# EAGLE design openevse-ac-filter-eagle7 (EAGLE 7.7.0)
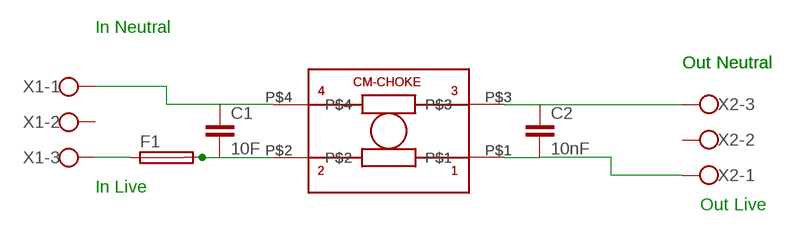
[diagram p0: schematic, sheet 1]

## Parts
C1  10F  C5/2.5  [C5B2.5]
C2  10nF  C5/2.5  [C5B2.5]
F1  GSH15  [GSH15]
U$1  47mH  RN114-0.3-02-47M  [RN114-0.3-02-47M]
U$2  RN214-0.3-02-47M  [RN214-0.3-02-47M]
X1  W237-103  [W237-103]
X2  W237-103  [W237-103]

## Nets
N$1: C1.1 U$1.P$4 U$2.P$4 X1.1
N$2: C1.2 F1.2 U$1.P$2 U$2.P$2
N$3: C2.1 U$1.P$3 U$2.P$3 X2.3
N$4: C2.2 U$1.P$1 U$2.P$1 X2.1
N$5: F1.1 X1.3
Unconnected: X1.2 X2.2

## Notes on the sheet
- In Neutral
- Out Neutral | Out Neutral
- In Live
- Out Live

## Library data of the parts
C1 C2 = capacitor-wima:C: CAPACITOR naming: grid - package width
F1 = fuse:GSH15: FUSE HOLDER grid 15mm, 19649 Wickmann; MPN: 64900001039; OC_FARNELL: 1271673; OC_NEWARK: 02P0318
U$1 = Schaffner-CM-Choke:RN114-0.3-02-47M
U$2 = Schaffner-CM-Choke:RN214-0.3-02-47M
X1 X2 = con-wago-500:W237-103: WAGO SCREW CLAMP; MPN: 237-103; OC_FARNELL: unknown; OC_NEWARK: 18M7116

## Board
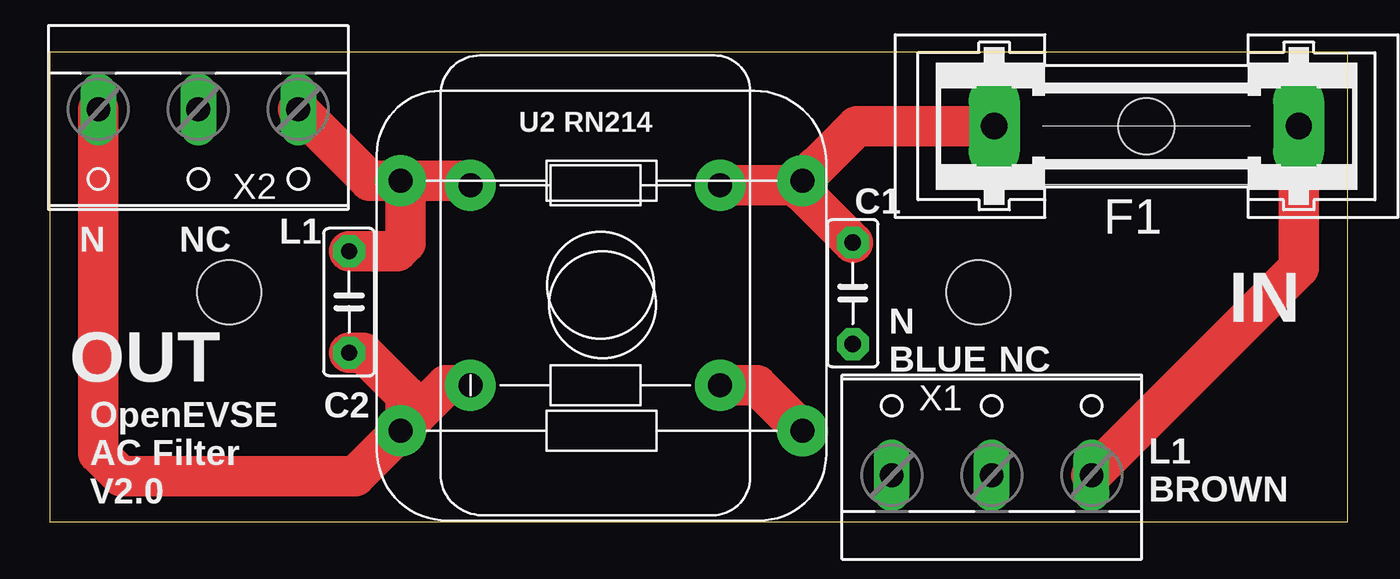
[diagram p1: board, top side]
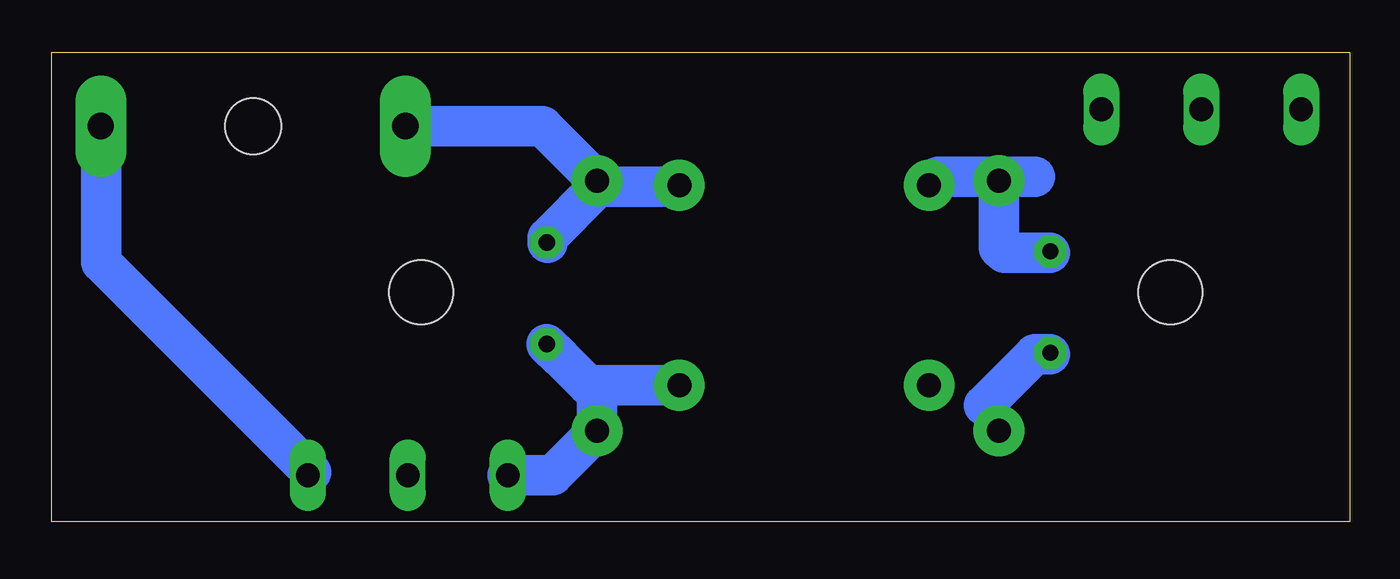
[diagram p2: board, bottom side, seen from below]

Size 64.94 x 23.5 mm. Coordinates in mm from the lower left corner, seen from the top.
Outline: 0,0 64.94,0 64.94,23.5 0,23.5 0,0
Copper layers (1*16): Top 0.035mm / dielectric 1.5mm / Bottom 0.035mm
Design rules "default": minimum track width 10mil, minimum drill 24mil, track to track 8mil, track to pad 8mil, pad to pad 8mil, via to via 8mil, smd to smd 8mil, copper to edge 40mil, drill to drill 8mil, minimum pad ring 10mil, minimum via ring 8mil, stop-mask expansion 4mil, vias tented up to drill 0mil, thermal gap 10mil
Holes 3.2 mm at 8.97,11.5 46.47,11.5

### Footprints (pad centres in the part's own frame; a part is rotated, then mirrored left to right if it is on the bottom)
C5B2.5 = drill 0.813 pad 1.6 octagon: 1 -2.54,0; 2 2.54,0
GSH15 = drill 1.321 pad 2.54 long: 1 -7.62,0; 2 7.62,0 | hole 2.794: 0,0
RN114-0.3-02-47M = drill 1.2 pad 2.54: P$1 9.87,-5.66; P$2 -10.23,-5.66; P$3 9.87,6.84; P$4 -10.23,6.84
RN214-0.3-02-47M = drill 1.2 pad 2.54: P$1 14,6.5; P$2 1.5,6.5; P$3 14,16.5; P$4 1.5,16.5
W237-103 = drill 1.194 long: 1 -5,-1.29; 2 0,-1.29; 3 5,-1.29

### Placement (x,y rotation side)
C1  40.17,11.44 90 top
C2  14.97,11 90 top
F1  54.87,19.8 180 top
U$1  27.42,11.41 180 top
U$2  35.04,23.34 180 top
X1  47.12,3.63 0 top
X2  7.42,19.35 180 top

### Tracks (layer width: path | path; a pad name or v marks a point on that pad's centre or on a via)
N$1
  Top 2.032: U$2.P$4 35.38,6.84 U$1.P$4
  Bottom 2.032: X1.1 39.88,2.34 U$1.P$4 37.65,6.38 39.47,8.21 | 39.47,8.21 C1.1 | U$2.P$4 38.11,6.84 39.47,8.21
N$2
  Top 2.032: U$2.P$2 37.42,16.84 U$1.P$2 | 38.36,17.78 U$1.P$2 | U$1.P$2 37.65,16.5 C1.2 | U$1.P$2 40.38,19.8 F1.2
  Bottom 2.032: U$1.P$2 40.38,19.8 F1.2
N$3
  Top 2.032: X2.3 2.42,3.43 3.56,2.29 15.26,2.29 U$1.P$3 17.79,4.81 | C2.1 15.68,8.46 17.79,6.35 17.79,4.81 | U$2.P$3 19.82,6.84 17.79,4.81
N$4
  Top 2.032: C2.2 17.36,13.54 17.79,13.97 17.79,16.83 U$1.P$1 | U$1.P$1 15.99,17.07 X2.1 | U$1.P$1 20.81,17.07 U$2.P$1
N$5
  Top 2.032: X1.3 62.49,12.71 F1.1
N$7
  Bottom 2.032: 51.97,2.5 62.47,13 62.47,20
N$10
  Bottom 2.032: 14.99,8.38 15.76,8.38 18.3,5.84
N$11
  Bottom 2.032: 14.99,13.46 17.28,13.46 17.53,13.72 17.53,16.76
N$12
  Bottom 2.032: 15.76,17.27 20.58,17.27 21.09,16.76
N$13
  Bottom 2.032: 33.54,16.76 37.35,16.76 37.6,17.02 37.6,17.27
N$14
  Bottom 2.032: 40.14,13.97 40.14,14.22 37.6,16.76

### Text on the board
tPlace: N | NC | L1 | IN | N / BLUE | NC | OUT | L1 / BROWN | OpenEVSE / AC Filter / V2.0
tNames: U2 RN214